# EAGLE design Adafruit CCS811 STEMMA QT (EAGLE 9.6.2)
COMPANY: ADAFRUIT INDUSTRIES; DRAWN: KTOWN; REV: A
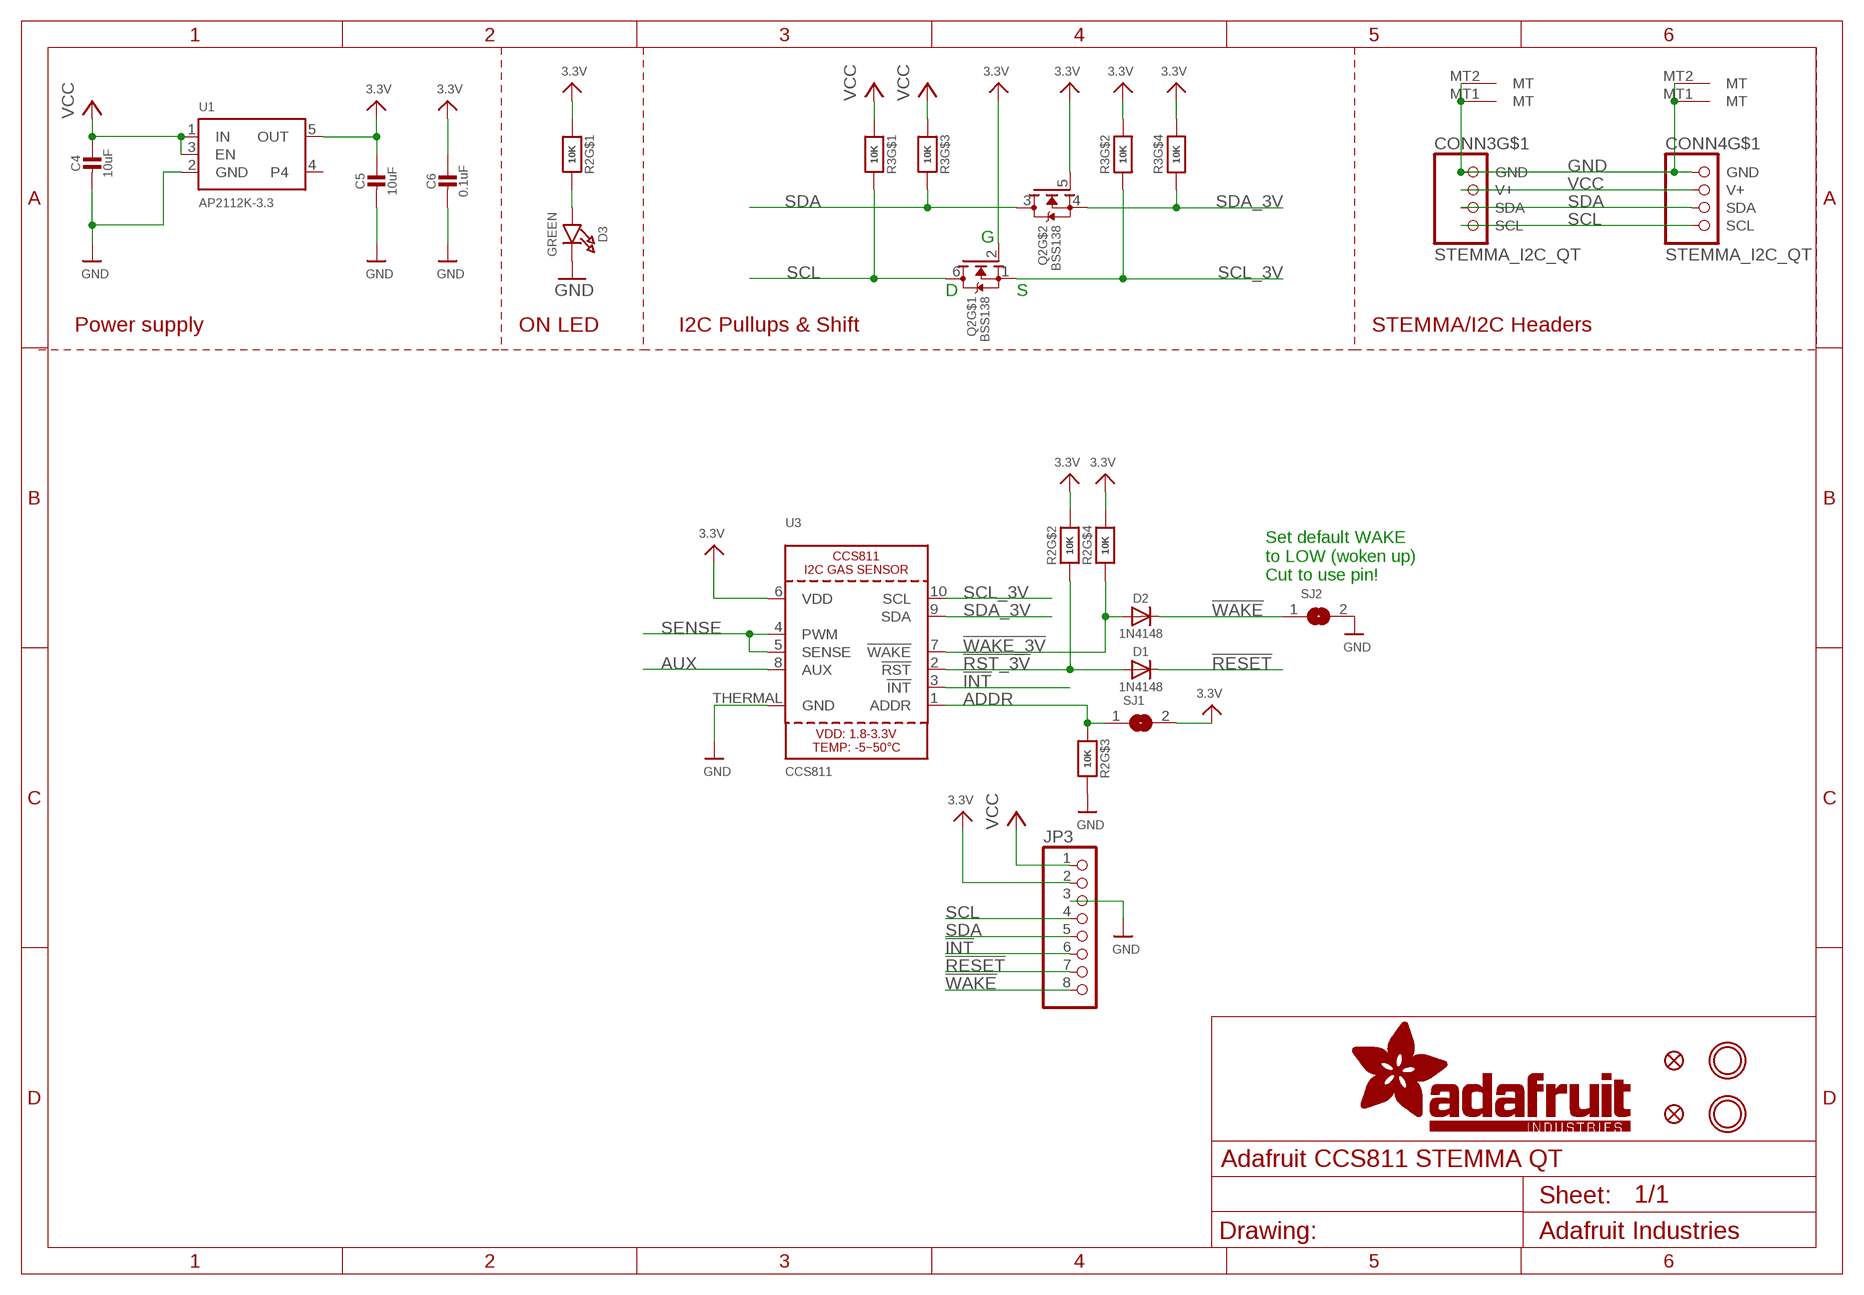
[diagram p0: schematic, sheet 1]

## Parts
C4  10uF  CAP_CERAMIC0805-NOOUTLINE  [0805-NO]
C5  10uF  CAP_CERAMIC0805-NOOUTLINE  [0805-NO]
C6  0.1uF  CAP_CERAMIC0603_NO  [0603-NO]
CONN3  STEMMA_I2C_QT  [JST_SH4]
CONN4  STEMMA_I2C_QT  [JST_SH4]
D1  1N4148  DIODESOD-323  [SOD-323]
D2  1N4148  DIODESOD-323  [SOD-323]
D3  GREEN  LED0603_NOOUTLINE  [CHIPLED_0603_NOOUTLINE]
FID3  FIDUCIAL_1MM  [FIDUCIAL_1MM]
FID4  FIDUCIAL_1MM  [FIDUCIAL_1MM]
JP3  HEADER-1X870MIL  [1X08_ROUND_70]
Q2  BSS138  MOSFET-N_DUAL  [SOT363]
R2  10K  RESISTOR_4PACK  [RESPACK_4X0603]
R3  10K  RESISTOR_4PACK  [RESPACK_4X0603]
SJ1  SOLDERJUMPER  [SOLDERJUMPER_ARROW_NOPASTE]
SJ2  SOLDERJUMPERCLOSED  [SOLDERJUMPER_CLOSEDWIRE]
U1  AP2112K-3.3  VREG_SOT23-5  [SOT23-5]
U3  CCS811  [CCS811]
U$39  MOUNTINGHOLE2.5  [MOUNTINGHOLE_2.5_PLATED]
U$40  MOUNTINGHOLE2.5  [MOUNTINGHOLE_2.5_PLATED]

## Nets
3.3V: C5.1 C6.1 JP3.2 Q2.2(G) Q2.5(G) R2.1 R2.5 R2.7 R3.2 R3.4 SJ1.2 U1.5(OUT) U3.6(VDD)
!INT: JP3.6 U3.3(!INT)
!RESET: D1.C JP3.7
!RST_3V: D1.A R2.2 U3.2(!RST)
!WAKE: D2.C JP3.8 SJ2.1
!WAKE_3V: D2.A R2.4 U3.7(!WAKE)
ADDR: R2.3 SJ1.1 U3.1(ADDR)
AUX: U3.8(AUX)
GND: C4.2 C5.2 C6.2 CONN3.1(GND) CONN3.MT1(MT) CONN3.MT2(MT) CONN4.1(GND) CONN4.MT1(MT) CONN4.MT2(MT) D3.C JP3.3 R2.6 SJ2.2 U1.2(GND) U3.THERMAL(GND)
N$3: D3.A R2.8
SCL: CONN3.4(SCL) CONN4.4(SCL) JP3.4 Q2.6(D) R3.8
SCL_3V: Q2.1(S) R3.7 U3.10(SCL)
SDA: CONN3.3(SDA) CONN4.3(SDA) JP3.5 Q2.3(D) R3.6
SDA_3V: Q2.4(S) R3.5 U3.9(SDA)
SENSE: U3.4(PWM) U3.5(SENSE)
VCC [highpower]: C4.1 CONN3.2(V+) CONN4.2(V+) JP3.1 R3.1 R3.3 U1.1(IN) U1.3(EN)
Unconnected: U1.4

## Notes on the sheet
- G
- D | S
- Power supply | ON LED | I2C Pullups & Shift | STEMMA/I2C Headers
- Set default WAKE
  to LOW (woken up)
  Cut to use pin!

## Library data of the parts
C4-C6 = microbuilder:CAP_CERAMIC: Ceramic Capacitors For new designs, use the packages preceded by an '_' character since they are more reliable: The following footprints should be used on most boards: _0402 - Standard footprint for regular board layouts _0603 - Standard footprint for regular board layouts _0805 - Standard footprint for regular board layouts _1206 - Standard footprint for regular board layouts For extremely tight-pitch boards where space is at a premium, the following 'micro-pitch' footprints can be used (smaller pads, no silkscreen outline, etc.): _0402MP - Micro-pitch footprint for very dense/compact boards _0603MP - Micro-pitch footprint for very dense/compact boards _0805MP - Micro-pitch footprint for very dense/compact boards _1206MP - Micro-pitch footprint for very dense/compact boards
CONN3 CONN4 = microbuilder:STEMMA_I2C
D1 D2 = microbuilder:DIODE: Diode SMA Model Volts Amps Type Vf Ir Digikey # Notes SSA34-E3 40V 3A Schottky 480mV @ 3A 200uA @ 40V SSA34-E3/61TGITR-ND CDBA120-G 20V 1A Schottky 500mV @ 1A 500uA @ 20V 641-1014-6-ND REEL MBRA210 10V 2A Schottky 350mV @ 2A 700uA @ 10V MBRA210LT3 SOD-123 Model Volts Amps Type Vf Ir Order # Notes BAT54T1G 30V 200mA Schottky 800mV @ 200mA 2uA @ 25V BAT54T1GOSTR-ND B0530W 30V 500mA Schottky 430mV @ 500mA 130uA @ 30V B0530W-FDICT-ND REEL MBR120 20V 1A Schottky 340mV @ 1A MBR120VLSFT1GOSCT-ND SOD-323 Model Volts Amps Type Vf Ir Order # Notes PMEG2005EJ 20V 500mA Schottky 355mV @ 500mA 568-4110-1-ND ZLLS410 10V 570mA Schottky 380mV @ 570mA ZLLS410CT-ND 1N4148WS 75V 150mA Silicon/Simple 1V 1N4148WSFSCT-ND REEL SOD-523 Model Volts Amps Type Vf Ir Order # Notes BAT54XV2 30V 200mA Schottky 0.8V @ 100mA BAT54XV2CT-ND TB751S 30V 30mA Schottky RB751S-40TE61CT-ND SOT23-R/W (R = Solder Paste/Reflow Ovens, W = Hand-Soldering) Model Volts Amps Type Vf Ir Order # Notes BAT54FILM 40V 300mA Schottky 497-7162-1-ND POWERDI-5 Model Volts Amps Type Vf Ir Order # Notes PDS560 60V 5A Schottky 670mV @ 5A 150uA @ 60V PDS560DICT-ND
D3 = microbuilder:LED: LED 0603 - 0603 Surface Mount Package 2mA: Green LED - Low Power (3.9mcd, 2ma, 1.7Vf) - Digikey: 475-2709-2-ND Orange LED - Low Power (9.8mcd, 2ma, 1.8Vf) - Digikey: 475-1194-2-ND Red LED - Low Power (5mcd, 2ma, 1.8Vf) - Digikey: 475-1195-2-ND Yellow LED - Low Power (7mcd, 2ma, 1.8Vf) - Digikey: 475-1196-2-ND 5mA: Blue LED - Low Power (17mcd, 5ma, 2.9Vf) - Digikey: LNJ937W8CRACT-ND 0805 - 0805 Surface Mount Package 2mA: Red LED (8.8mcd, 2mA, 1.8Vf, Clear) - Low Power [Digikey: 475-2510-1-ND] Green LED (5mcd, 2mA, 1.8Vf, Clear) - Low Power [Digikey: 475-2730-1-ND] Yellow LED (11.3mcd, 2mA, 1.8Vf, Clear) - Low Power [Digikey: 475-2555-1-ND] 20mA: Red LED (104mcd, 20mA, Diffused) - LS R976 [Digikey: 475-1278-6-ND] Red LED (12mcd, 20mA, 2.0Vf, Clear) - APT2012EC [Digikey: 754-1128-1-ND] Green LED (15mcd, 20mA, 2.2Vf, Clear) - APT2012GC [Digikey: 754-1131-1-ND] Orange LED (160mcd, 20mA, 2.1Vf, Clear) - APT2012SECK [Digikey: 754-1130-1-ND] 1206 - 1206 Surface Mount Package Green LED (26mcd, 20mA, Diffused) - LG N971 [Digikey: 475-1407-6-ND] Red LED (15mcd, 20mA, Diffused) - LH N974 [Digikey: 475-1416-6-ND] Cree - Cree High-Power Surface Mount LEDs XPEBWT-L1-0000-00D50 - White 111lm 350mA 2.9Vf 6200K 110° XTEAWT-00-0000-00000LEE3 - White 114lm 350mA 2.85Vf 5000K 115° Everlight - Everlight 45-21 Series Surface Mount LEDs 45-21/QK2C-B2832AC2CB2/2T - Warm White 2000mcd 20mA 3.25Vf 3050K 120° 45-21/LK2C-B38452C4CB2/2T - Nuetral White 2000mcd 20mA 3.25Vf 4150K 120° 45-21/LK2C-B50634C6CB2/2T - Cold White 2200mcd 20mA 3.25Vf 5650K 120° PLCC2 Reverse Mount LS T77K-J1L2-1-0-2-R18-Z - Red 11.25mcd 2mA 1.8Vf 630nm 120° LO T77K-L1M2-24-Z - Orange 19.6mcd 2mA 1.8Vf 606nm 120° LY T77K-K2M1-26-Z - Yellow 15.7mcd 2mA 1.8Vf 587nm 120°
FID3 FID4 = microbuilder:FIDUCIAL: Fiducial Alignment Points Various fiducial points for machine vision alignment.; BOM: EXCLUDE
JP3 = microbuilder:HEADER-1X8: PIN HEADER
Q2 = microbuilder:MOSFET-N_DUAL: Dual N-Channel MOSFET SOT363 (2.0x1.25mm) 2N7002PS - 60V, 320mA [Digikey: 568-5984-1-ND]
R2 R3 = microbuilder:RESISTOR_4PACK: Resistor Packs (4 resistors) 4 x 0603 10K 1/16W - Digikey: YC164J-10KCT-ND
SJ1 = microbuilder:SOLDERJUMPER: SMD Solder JUMPER Solder the two pads together to create a connection, or remove the solder to break it. REFLOW - Use this footprint for solder paste and reflow ovens. WAVE - Use this footprint for hand-soldering (larger pads). CLOSED - Has a trace between the two pads to ensure it is closed by default. The trace needs to be cut to disable the jumper, and can be closed again by creating a solder bridge between the two pads.; BOM: EXCLUDE
SJ2 = microbuilder:SOLDERJUMPER: SMD Solder JUMPER Solder the two pads together to create a connection, or remove the solder to break it. REFLOW - Use this footprint for solder paste and reflow ovens. WAVE - Use this footprint for hand-soldering (larger pads). CLOSED - Has a trace between the two pads to ensure it is closed by default. The trace needs to be cut to disable the jumper, and can be closed again by creating a solder bridge between the two pads.
U1 = microbuilder:VREG_SOT23-5: SOT23-5 Fixed Voltage Regulators Part Current Out V Out V In V Dropout θJA (°C/W) TJ (°C) Digikey Part No. ADP121 150mA 3.3V 3.4-5.5V 0.09V @ 150mA -- -- ADP121-AUJZ33R7CT-ND ADP121 150mA 3.0V 3.1-5.5V 0.09V @ 150mA -- -- ADP121-AUJZ30R7CT-ND ADP122 300mA 3.3V 3.4-5.5V 0.085V @ 300mA -- -- ADP122AUJZ-3.3-R7CT-ND ADP1712 300mA 3.3V 3.5-5.5V 0.17V @ 300mA -- -- ADP1712AUJZ-3.3-R7TR-ND AP7311 (Low Cost) 150mA 3.3V 3.5-6V 0.15V @ 150mA -- -- AP7311-33WG-7DICT-ND LD39015M18R 150mA 1.8V 1.9V-5.5V 0.08V @ 100mA -- -- 497-6977-1-ND LP2985A-33DBVR 150mA 3.3V 3.3-16V 0.28V @ 150mA 206 150 296-18479-1-ND MCP1824T-3302E/OT 300mA 3.3V 3.5V-6V 0.2V @ 300mA -- -- MCP1824T-3302E/OTCT-ND MIC5205-2.5YM5 TR 150mA 2.5V 2.7-16V 0.165V @ 150mA -- -- 576-1257-2-ND MIC5205-3.0YM5 TR 150mA 3.0V 3.2V-16V 0.165V @ 150mA -- -- 576-1258-2-ND MIC5205-3.3YM5 TR 150mA 3.3V 3.5V-16V 0.165V @ 150mA -- -- 576-1259-2-ND TPS780330220 150mA 3.3V+2.2V 3.6-5.5V 250mV Max -- -- 296-23332-1-ND TDA3663/N1,135 100mA 3.3V 3.5-45V 0.18V @ 50mA -- -- 568-5343-1-ND Max operating temp can be calculated using θJA, TJ (max junction temperature), and power in watts. Set the "Maximum Ambient Temperature" until it reaches TJ ("Max Junction Temperature"), which is the absolute limit for safe use of the regulator: Heat Sink Temperature Calculator <http://www.daycounter.com/Calculators/Heat-Sink-Temperature-Calculator.phtml> For example, With 12V source into a 3.3V LP2985 and a 30mA load, we are dissipating (12V-3.3V) * 0.03A = 0.261W. With a θJA of 206 °C/W, a TJ of 150°C, and 261mW we can safely use the chip without a heat sink up to 75°C (=147.1°C Junction Temperature).
U3 = microbuilder:CCS811: CCS811 - I2C Gas and Air Quality Sensor
U$39 U$40 = microbuilder:MOUNTINGHOLE: Mounting Hole For #2 screws (0.086"/2.18mm width, 0.094"/2.4mm hole) use 2.5mm; BOM: EXCLUDE

## Net classes
1 highpower: width 0.305 mm, drill 0.483 mm
2 lowpower: width 0.254 mm, drill 0.483 mm

## Board
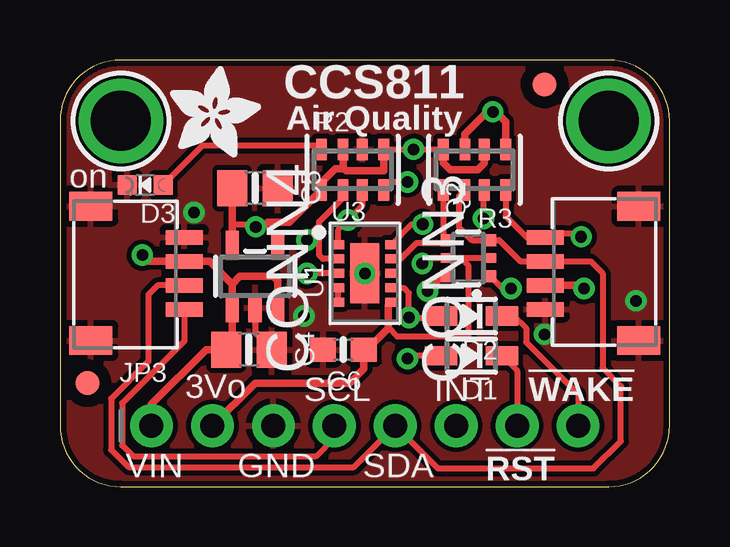
[diagram p1: board, top side]
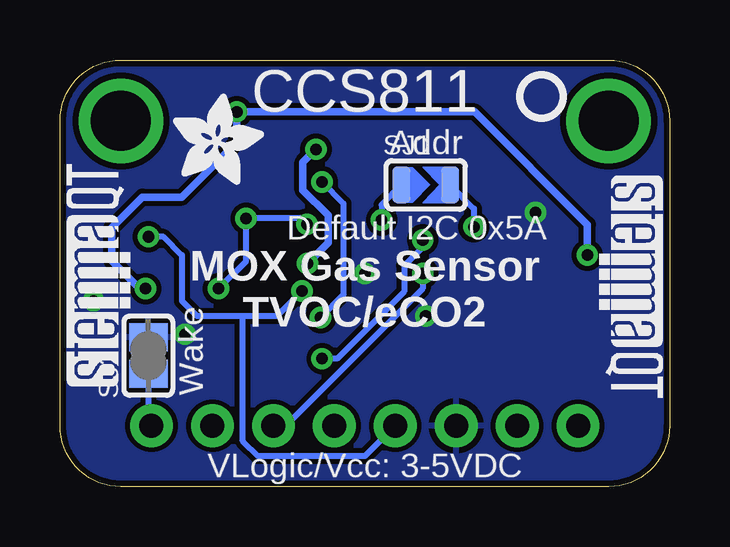
[diagram p2: board, bottom side, seen from below]

Size 25.4 x 17.78 mm. Coordinates in mm from the lower left corner, seen from the top.
Outline: 0,15.24 0,2.54 arc90 2.54,0 22.86,0 arc90 25.4,2.54 25.4,15.24 arc90 22.86,17.78 2.54,17.78 arc90 0,15.24
Copper layers (1*16): Top 0.035mm / dielectric 1.5mm / Bottom 0.035mm
Design rules "adafruit *": minimum track width 8mil, minimum drill 15.5mil, track to track 8mil, track to pad 8mil, pad to pad 8mil, via to via 8mil, smd to smd 8mil, copper to edge 10mil, drill to drill 8mil, minimum pad ring 10mil, minimum via ring 8mil, stop-mask expansion 2mil, vias tented up to drill 20mil, thermal gap 10mil

### Footprints (pad centres in the part's own frame; a part is rotated, then mirrored left to right if it is on the bottom)
0805-NO = smd 1.24 x 1.5: 1 -0.95,0; 2 0.95,0
0603-NO = smd 1.075 x 1: 1 -0.85,0; 2 0.85,0
JST_SH4 = smd 0.6 x 1.55: 1 -1.5,2.514; 2 -0.5,2.514; 3 0.5,2.514; 4 1.5,2.514 | smd 1.2 x 1.8: MT1 -2.8,-1.386; MT2 2.8,-1.386
SOD-323 = smd 1.35 x 0.8: A 1.27,0; C -1.27,0
CHIPLED_0603_NOOUTLINE = smd 0.8 x 0.8: A 0,-0.75; C 0,0.75
FIDUCIAL_1MM = smd 1 x 1: 1 0,0
1X08_ROUND_70 = drill 1 pad 1.778: 1 -8.89,0; 2 -6.35,0; 3 -3.81,0; 4 -1.27,0; 5 1.27,0; 6 3.81,0; 7 6.35,0; 8 8.89,0
SOT363 = smd 0.5 x 0.5: 1 -0.75,-0.9; 3 0.75,-0.9; 4 0.75,0.9; 6 -0.75,0.9 | smd 0.4 x 0.5: 2 0,-0.9; 5 0,0.9
RESPACK_4X0603 = smd 0.45 x 0.9: 1 -1.3,-0.85; 2 -0.4,-0.85; 3 0.4,-0.85; 4 1.3,-0.85; 5 1.3,0.85; 6 0.4,0.85; 7 -0.4,0.85; 8 -1.3,0.85
SOLDERJUMPER_ARROW_NOPASTE = smd 0.762 x 1.524: 1 -1.016,0; 2 1.016,0
SOLDERJUMPER_CLOSEDWIRE = smd 1.168 x 1.6: 1 -0.762,0; 2 0.762,0 | smd 0.635 x 0.203: WIRE 0,0
SOT23-5 = smd 0.55 x 1.2: 1 -0.95,-1.3; 2 0,-1.3; 3 0.95,-1.3; 4 0.95,1.3; 5 -0.95,1.3
CCS811 = smd 0.5 x 0.375: 1 -1.1,1.2; 2 -1.1,0.6; 3 -1.1,0; 4 -1.1,-0.6; 5 -1.1,-1.2; 6 1.1,-1.2; 7 1.1,-0.6; 8 1.1,0; 9 1.1,0.6; 10 1.1,1.2 | smd 1.2 x 2.5: THERMAL 0,0
MOUNTINGHOLE_2.5_PLATED = drill 2.5 pad 3.2: P$1 0,0

### Placement (x,y rotation side)
C4  7.87,5.71 0 top
C5  8.13,12.45 0 top
C6  11.81,5.71 180 top
CONN3  22.73,8.89 90 top
CONN4  2.67,8.89 270 top
D1  17.14,5.46 180 top
D2  17.14,7.11 180 top
D3  3.56,12.57 90 top
FID3  1.14,4.32 0 top
FID4  20.19,16.76 0 top
JP3  12.7,2.54 0 top
Q2  17.02,9.53 90 top
R2  12.19,13.21 0 top
R3  17.27,13.21 180 top
SJ1  10.16,12.57 0 bottom
SJ2  21.72,5.46 90 bottom
U1  8.13,8.76 0 top
U3  12.7,8.89 0 top
U$1  [ADAFRUIT_3.5MM]  20.7,12.57 0 bottom
U$39  2.54,15.24 0 top
U$40  22.86,15.24 0 top
U$45  [ADAFRUIT_3.5MM]  4.57,13.72 0 top
U$46  [PCBFEAT-REV-040]  5.33,16.26 0 bottom
U$47  [STEMMAQT]  22.48,4.19 90 bottom
U$48  [STEMMAQT]  2.92,12.95 270 bottom

### Tracks (layer width: path | path; a pad name or v marks a point on that pad's centre or on a via)
3.3V  (via drill 0.48)
  Top 0.254: Q2.2 Q2.5 | Q2.5 15.32,9.53 v15.09,9.3 | Q2.5 16.72,9.53 17.01,9.23 17.01,6.25 14.05,6.25 13.69,6.62 | R2.5 v14.73,14.06 R3.4 | v8.15,10.83 8.06,10.92 7.18,10.92
  Top 0.305: U1.5 7.18,10.92 C5.1 | JP3.2 8.13,4.32 12.06,4.32 12.66,4.91 12.66,5.59 | 12.66,5.59 C6.1 | U3.6 13.67,7.56 13.67,6.6 | 13.69,6.62 13.67,6.6 | 13.67,6.6 12.66,5.59 | R2.5 13.49,13.16 11.93,13.16 11.79,13.3 R2.7 11.79,13.27 11.77,13.25 11.47,13.25 10.89,12.67 R2.1 10.41,11.88 9.55,11.02 8.66,11.02 8.47,10.83 v8.15,10.83 | R3.4 15.97,13.49 16.26,13.21 17.4,13.21 17.67,13.48 R3.2
  Bottom 0.254: SJ1.2 8.15,11.58 v8.15,10.83
  Bottom 0.305: v15.09,9.3 14.22,10.17 14.22,11.3 15.28,12.36 15.28,13.51 v14.73,14.06
!INT  (via drill 0.48)
  Top 0.254: U3.3 v10.29,8.89
  Bottom 0.254: v10.29,8.89 10.29,8.26 16,2.54 JP3.6
!RESET
  Top 0.254: D1.C 19.05,4.83 JP3.7
!RST_3V  (via drill 0.48)
  Top 0.254: U3.2 10.96,9.49 10.79,9.65 10.79,10.92 | 10.79,10.92 10.79,11.05 11.79,12.05 R2.2 | 10.79,10.92 10.22,10.35 v10.29,10.29 | D1.A 14.61,5.46 v14.48,5.33
  Bottom 0.254: v10.29,10.29 10.29,9.99 11.06,9.21 11.06,8.13 13.86,5.33 v14.48,5.33
!WAKE
  Top 0.254: D2.C 18.92,7.11 19.42,6.62 19.42,6.03 21.59,3.86 JP3.8
  Bottom 0.254: SJ2.1 21.72,2.67 JP3.8
!WAKE_3V  (via drill 0.48)
  Top 0.254: U3.7 14.32,8.29 14.54,8.06 v14.54,7.05 15.81,7.05 D2.A | R2.4 13.83,12.7 v14.48,12.7
  Bottom 0.254: v14.48,12.7 13.59,11.81 13.59,8 v14.54,7.05
ADDR  (via drill 0.48)
  Top 0.254: U3.1 11.6,10.71 v12,11.11 12.59,11.7 R2.3
  Bottom 0.254: SJ1.1 12,11.75 v12,11.11
GND  (via drill 0.48)
  Top 0.254: U1.2 8.13,6.41 C4.2
  other vias: 5.59,11.43 12.7,8.89 10.16,7.11 20.19,6.35 24,7.75
  pour Top: 0,17.78 25.4,17.78 25.4,0 0,0
  pour Bottom: 0,17.78 25.4,17.78 25.4,0 0,0
N$3
  Top 0.254: D3.A 5.96,14.22 10.73,14.22 R2.8
SCL  (via drill 0.48)
  Top 0.254: R3.8 18.57,11.27 19.45,10.39 CONN3.4 20.37,10.54 21.72,10.54 v21.72,10.41 | Q2.6 15.93,8.78 v15.32,8.16 | CONN4.4 5.18,6.07 2.59,3.48 2.59,1.73 3.05,1.27 10.67,1.27 11.43,2.03 JP3.4
  Bottom 0.254: v15.32,8.16 16.36,7.11 17.78,7.11 | 17.78,7.11 19.68,7.11 20.32,7.75 20.32,9.65 21.08,10.41 v21.72,10.41 | JP3.4 12.7,1.27 17.14,1.27 17.78,1.91 17.78,7.11
SCL_3V  (via drill 0.48)
  Top 0.254: Q2.1 18.44,8.26 v18.8,8.26 | v17.65,11.18 17.65,12.33 R3.7 | U3.10 14.64,10.94 v15.11,10.94
  Bottom 0.254: v18.8,8.26 17.65,9.4 v17.65,11.18 15.35,11.18 v15.11,10.94
SDA
  Top 0.254: R3.6 16.62,12.1 16.62,10.81 17.16,10.28 Q2.3 18.3,10.28 19.18,9.39 CONN3.3 22.11,9.39 22.61,8.89 22.61,4.95 23.37,4.19 23.37,1.91 22.23,0.76 15.75,0.76 JP3.5 12.24,0.81 2.86,0.81 2.13,1.54 2.13,3.67 3.68,5.22 3.68,8 4.07,8.39 CONN4.3
SDA_3V
  Top 0.254: U3.9 14.19,9.49 14.86,10.16 15.98,10.16 | 15.98,10.16 16.23,10.16 Q2.4 | R3.5 15.97,10.17 15.98,10.16
SENSE
  Top 0.254: U3.5 U3.4
VCC  (via drill 0.48)
  Top 0.305: 7.18,8.45 6.23,9.39 CONN4.2 3.69,9.39 v3.43,9.65 | 7.18,8.45 7.18,8.44 U1.1 7.18,6.16 6.73,5.71 | U1.3 9.08,8.57 8.89,8.76 7.49,8.76 7.18,8.45 | JP3.1 3.81,3.43 6.1,5.71 6.73,5.71 | 6.73,5.71 C4.1 | R3.3 16.87,14.69 17.8,15.62 v18.03,15.62 18.16,15.62 18.57,15.21 R3.1 | CONN3.2 21.7,8.39 v21.83,8.26
  Bottom 0.305: v3.43,9.65 3.43,10.92 8.13,15.62 v18.03,15.62 18.03,14.35 20.32,12.06 21.97,12.06 23.24,10.79 23.24,9.41 22.09,8.26 v21.83,8.26

### Text on the board
tPlace: CCS811 | Air Quality | on | 3Vo | SCL | INT | !WAKE | VIN | GND | SDA | !RST
bPlace: CCS811 | Addr | Default I2C 0x5A | MOX Gas Sensor / TVOC/eCO2 | Wake | VLogic/Vcc: 3-5VDC